# EAGLE design Eitech-Robotics_v10dev (EAGLE 7.7.0)
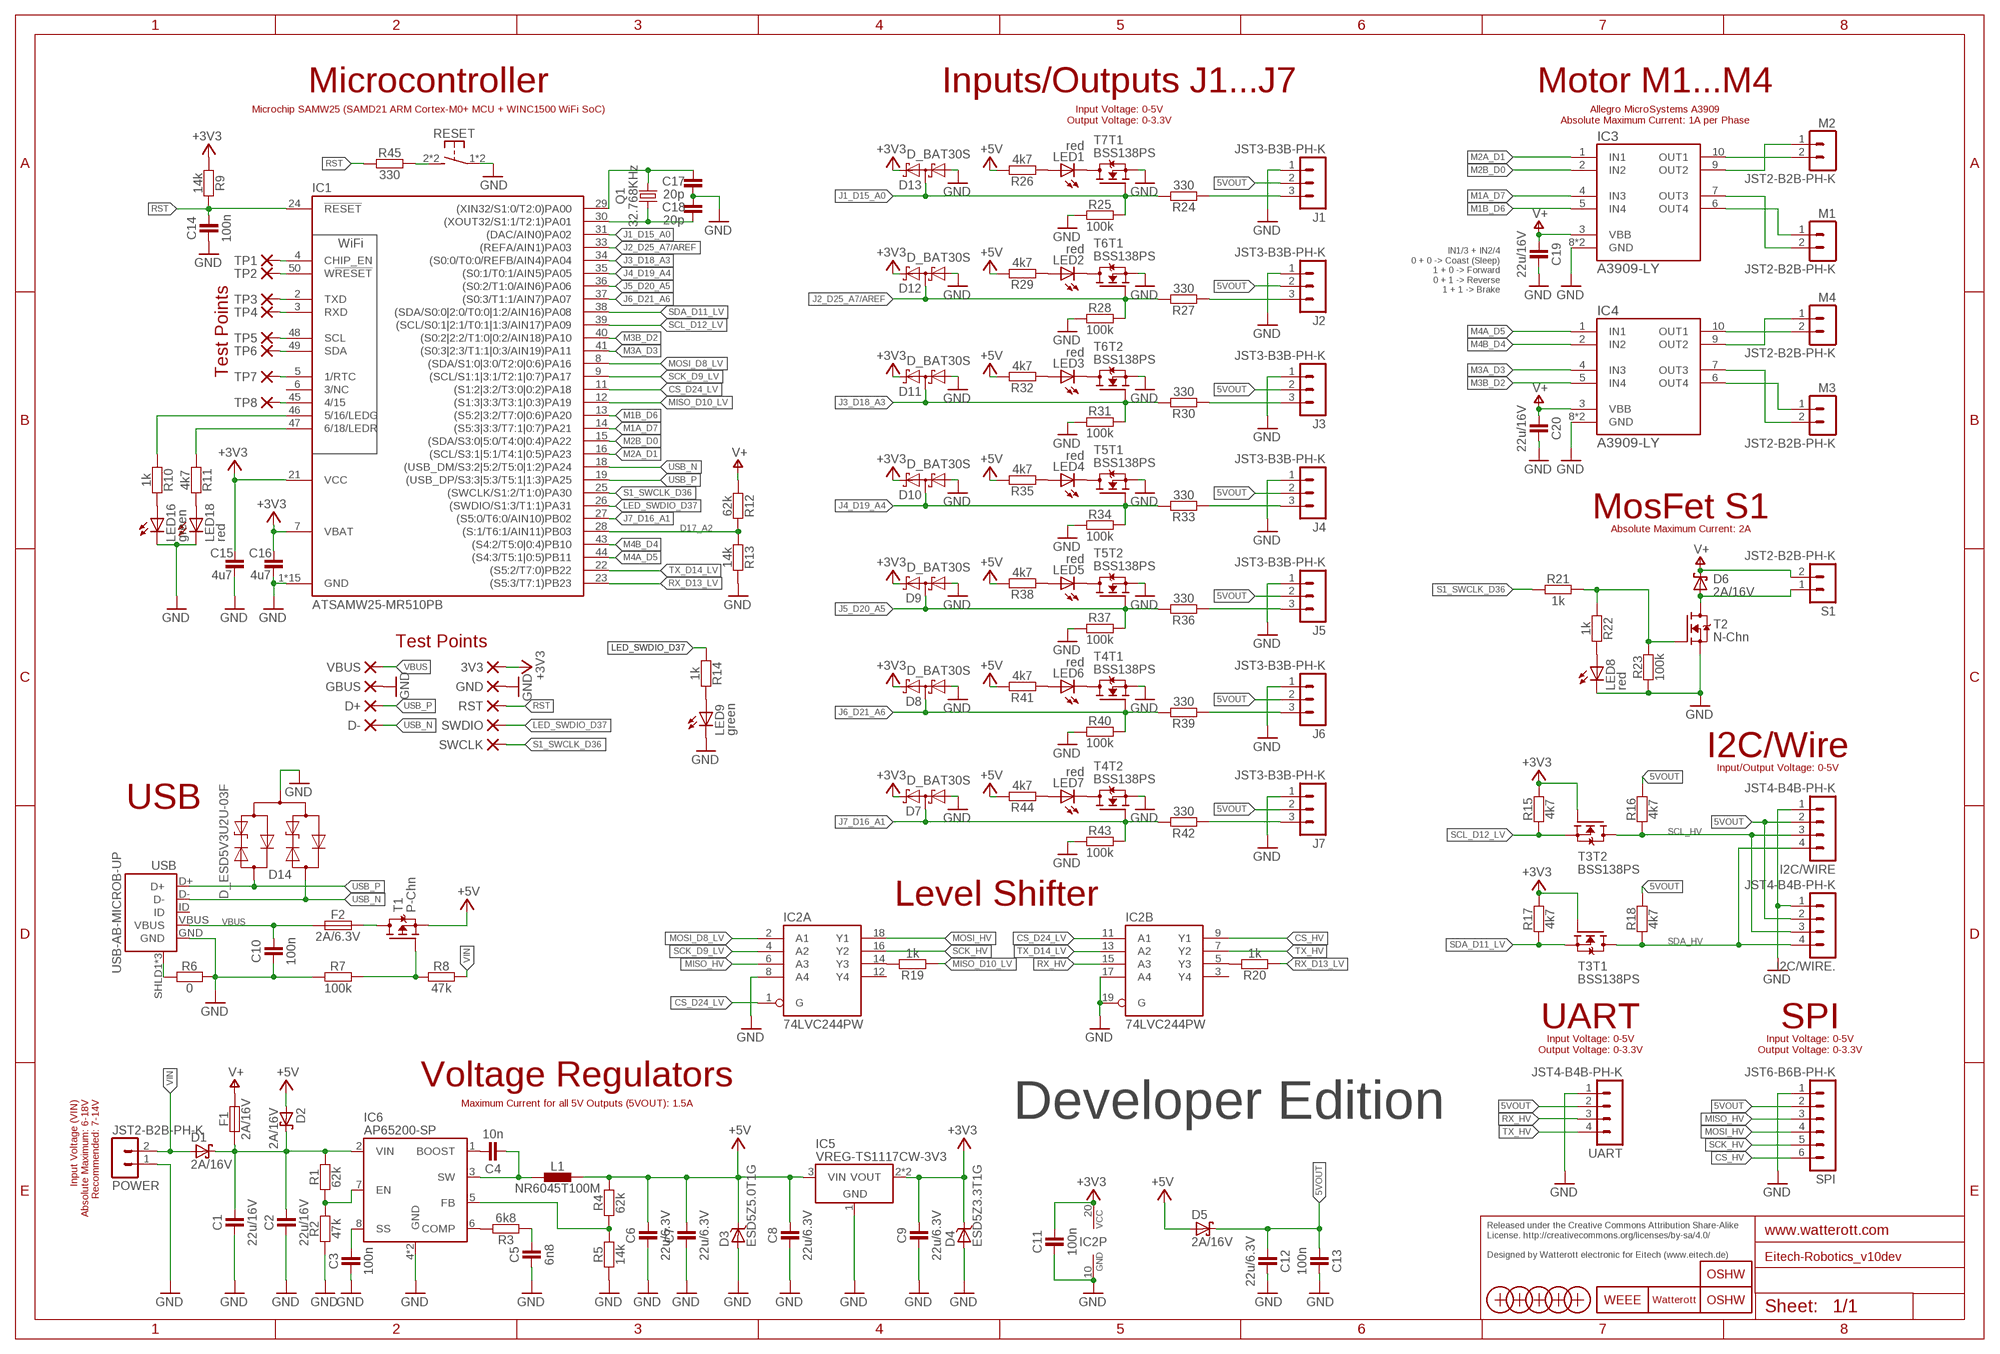
[diagram p0: schematic, sheet 1]

## Parts
3V3  PAD-1.0_NC  [PAD-1.0_NC]
C1  22u/16V  CAPACITOR-0805  [C0805]
C2  22u/16V  CAPACITOR-0805  [C0805]
C3  100n  CAPACITOR-0402  [C0402]
C4  10n  CAPACITOR-0402  [C0402]
C5  6n8  CAPACITOR-0402  [C0402]
C6  22u/6.3V  CAPACITOR-0805  [C0805]
C7  22u/6.3V  CAPACITOR-0805  [C0805]
C8  22u/6.3V  CAPACITOR-0805  [C0805]
C9  22u/6.3V  CAPACITOR-0805  [C0805]
C10  100n  CAPACITOR-0402  [C0402]
C11  100n  CAPACITOR-0402  [C0402]
C12  22u/6.3V  CAPACITOR-0805  [C0805]
C13  100n  CAPACITOR-0402  [C0402]
C14  100n  CAPACITOR-0402  [C0402]
C15  4u7  CAPACITOR-0603  [C0603]
C16  4u7  CAPACITOR-0603  [C0603]
C17  20p  CAPACITOR-0402  [C0402]
C18  20p  CAPACITOR-0402  [C0402]
C19  22u/16V  CAPACITOR-0805  [C0805]
C20  22u/16V  CAPACITOR-0805  [C0805]
D1  2A/16V  D_SCHOTTKY-SMA  [SMA_DO214AC]
D2  2A/16V  D_SCHOTTKY-SMA  [SMA_DO214AC]
D3  ESD5Z5.0T1G  D_TVS-SOD523  [SOD523]
D4  ESD5Z3.3T1G  D_TVS-SOD523  [SOD523]
D5  2A/16V  D_SCHOTTKY-SMA  [SMA_DO214AC]
D6  2A/16V  D_SCHOTTKY-SMA  [SMA_DO214AC]
D7  D_BAT30S  [SOT323]
D8  D_BAT30S  [SOT323]
D9  D_BAT30S  [SOT323]
D10  D_BAT30S  [SOT323]
D11  D_BAT30S  [SOT323]
D12  D_BAT30S  [SOT323]
D13  D_BAT30S  [SOT323]
D14  D_ESD5V3U2U-03F  [SOT723]
D+  PAD-1.0_NC  [PAD-1.0_NC]
D-  PAD-1.0_NC  [PAD-1.0_NC]
F1  2A/16V  FUSE-1812  [C1812]
F2  2A/6.3V  FUSE-1206  [C1206]
GBUS  PAD-1.0_NC  [PAD-1.0_NC]
GND  PAD-1.0_NC  [PAD-1.0_NC]
I2C/WIRE  JST4-B4B-PH-K  [JST_B4B-PH-K]
I2C/WIRE.  JST4-B4B-PH-K  [JST_B4B-PH-K]
IC1  ATSAMW25-MR510PB  [ATSAMW25-MRX10]
IC2  74LVC244PW  [TSSOP20]
IC3  A3909-LY  [MSOP10-PAD]
IC4  A3909-LY  [MSOP10-PAD]
IC5  VREG-TS1117CW-3V3  [SOT223]
IC6  AP65200-SP  [SO08-PAD]
J1  JST3-B3B-PH-K  [JST_B3B-PH-K]
J2  JST3-B3B-PH-K  [JST_B3B-PH-K]
J3  JST3-B3B-PH-K  [JST_B3B-PH-K]
J4  JST3-B3B-PH-K  [JST_B3B-PH-K]
J5  JST3-B3B-PH-K  [JST_B3B-PH-K]
J6  JST3-B3B-PH-K  [JST_B3B-PH-K]
J7  JST3-B3B-PH-K  [JST_B3B-PH-K]
L1  NR6045T100M  INDUCTOR-NR60XX  [L_NR60XX]
LED1  red  LED-0603  [C0603]
LED2  red  LED-0603  [C0603]
LED3  red  LED-0603  [C0603]
LED4  red  LED-0603  [C0603]
LED5  red  LED-0603  [C0603]
LED6  red  LED-0603  [C0603]
LED7  red  LED-0603  [C0603]
LED8  red  LED-0603  [C0603]
LED9  green  LED-0603  [C0603]
LED16  green  LED-0603  [C0603]
LED18  red  LED-0603  [C0603]
LOGO1  OSHW_LOGOX0100  [OSHW_6X100]
LOGO2  WEEE_LOGO-S  [WEEE_TPLAC_S]
LOGO3  LOGO-S_PLACE_S  [SPARK_TPLACE_S]
LOGO4  OSHW_LOGOX0150  [OSHW_6X150]
M1  JST2-B2B-PH-K  [JST_B2B-PH-K]
M2  JST2-B2B-PH-K  [JST_B2B-PH-K]
M3  JST2-B2B-PH-K  [JST_B2B-PH-K]
M4  JST2-B2B-PH-K  [JST_B2B-PH-K]
POWER  JST2-B2B-PH-K  [JST_B2B-PH-K]
Q1  32.768KHz  CRYSTAL-ZM315  [CRYSTAL_ZM315]
R1  62k  RESISTOR-0402  [C0402]
R2  47k  RESISTOR-0402  [C0402]
R3  6k8  RESISTOR-0402  [C0402]
R4  62k  RESISTOR-0402  [C0402]
R5  14k  RESISTOR-0402  [C0402]
R6  0  RESISTOR-0402  [C0402]
R7  100k  RESISTOR-0402  [C0402]
R8  47k  RESISTOR-0402  [C0402]
R9  14k  RESISTOR-0402  [C0402]
R10  1k  RESISTOR-0402  [C0402]
R11  4k7  RESISTOR-0402  [C0402]
R12  62k  RESISTOR-0402  [C0402]
R13  14k  RESISTOR-0402  [C0402]
R14  1k  RESISTOR-0402  [C0402]
R15  4k7  RESISTOR-0402  [C0402]
R16  4k7  RESISTOR-0402  [C0402]
R17  4k7  RESISTOR-0402  [C0402]
R18  4k7  RESISTOR-0402  [C0402]
R19  1k  RESISTOR-0402  [C0402]
R20  1k  RESISTOR-0402  [C0402]
R21  1k  RESISTOR-0402  [C0402]
R22  1k  RESISTOR-0402  [C0402]
R23  100k  RESISTOR-0402  [C0402]
R24  330  RESISTOR-0402  [C0402]
R25  100k  RESISTOR-0402  [C0402]
R26  4k7  RESISTOR-0402  [C0402]
R27  330  RESISTOR-0402  [C0402]
R28  100k  RESISTOR-0402  [C0402]
R29  4k7  RESISTOR-0402  [C0402]
R30  330  RESISTOR-0402  [C0402]
R31  100k  RESISTOR-0402  [C0402]
R32  4k7  RESISTOR-0402  [C0402]
R33  330  RESISTOR-0402  [C0402]
R34  100k  RESISTOR-0402  [C0402]
R35  4k7  RESISTOR-0402  [C0402]
R36  330  RESISTOR-0402  [C0402]
R37  100k  RESISTOR-0402  [C0402]
R38  4k7  RESISTOR-0402  [C0402]
R39  330  RESISTOR-0402  [C0402]
R40  100k  RESISTOR-0402  [C0402]
R41  4k7  RESISTOR-0402  [C0402]
R42  330  RESISTOR-0402  [C0402]
R43  100k  RESISTOR-0402  [C0402]
R44  4k7  RESISTOR-0402  [C0402]
R45  330  RESISTOR-0402  [C0402]
RESET  SW-TACTILE-TL3305C  SW-TACTILE-TL3305  [TL3305]
RST  PAD-1.0_NC  [PAD-1.0_NC]
S1  JST2-B2B-PH-K  [JST_B2B-PH-K]
SPI  JST6-B6B-PH-K  [JST_B6B-PH-K]
SWCLK  PAD-1.0_NC  [PAD-1.0_NC]
SWDIO  PAD-1.0_NC  [PAD-1.0_NC]
T1  P-Chn  MOSFET-P-SOT23  [SOT23]
T2  N-Chn  MOSFET-N-SOT23  [SOT23]
T3  BSS138PS  [SOT363]
T4  BSS138PS  [SOT363]
T5  BSS138PS  [SOT363]
T6  BSS138PS  [SOT363]
T7  BSS138PS  [SOT363]
TP1  PAD-0.7_NC  [PAD-0.7_NC]
TP2  PAD-0.7_NC  [PAD-0.7_NC]
TP3  PAD-0.7_NC  [PAD-0.7_NC]
TP4  PAD-0.7_NC  [PAD-0.7_NC]
TP5  PAD-0.7_NC  [PAD-0.7_NC]
TP6  PAD-0.7_NC  [PAD-0.7_NC]
TP7  PAD-0.7_NC  [PAD-0.7_NC]
TP8  PAD-0.7_NC  [PAD-0.7_NC]
UART  JST4-B4B-PH-K  [JST_B4B-PH-K]
USB  USB-AB-MICROB-UP  [USB-MICROB-1051330011]
VBUS  PAD-1.0_NC  [PAD-1.0_NC]
X1  PASSER-07  [PASSER_07MM]
X2  PASSER-07  [PASSER_07MM]
X3  PASSER-07  [PASSER_07MM]
X4  PASSER-07  [PASSER_07MM]
X5  PASSER-04  [PASSER_04MM]

## Nets
5VOUT: C12.2 C13.2 D5.C I2C/WIRE.2 I2C/WIRE..2 J1.2 J2.2 J3.2 J4.2 J5.2 J6.2 J7.2 R16.2 R18.2 SPI.2 UART.2
+3V3: 3V3.1(P) C9.2 C11.2 C15.2 C16.2 D4.C D7.2(C) D8.2(C) D9.2(C) D10.2(C) D11.2(C) D12.2(C) D13.2(C) IC1.7(VBAT) IC1.21(VCC) IC2.20(P:VCC) IC5.2(VOUT) IC5.4(VOUT) R9.1 R15.2 R17.2 T3.2(T1:G) T3.5(T2:G)
+5V: C6.2 C7.2 C8.2 D2.A D3.C D5.A IC5.3(VIN) L1.2 R4.2 R26.2 R29.2 R32.2 R35.2 R38.2 R41.2 R44.2 T1.2(S)
BOOST: C4.2 IC6.1(BOOST)
CHIP_EN: IC1.4(CHIP_EN) TP1.1(P)
COMP: IC6.6(COMP) R3.2
CS_D24_LV: IC1.11((S1:2|3:2/T3:0|0:2)PA18) IC2.1(A:G) IC2.11(B:A1)
CS_HV: IC2.9(B:Y1) SPI.6
D17_A2: IC1.28((S:1/T6:1/AIN11)PB03) R12.2 R13.1
GND: C1.1 C2.1 C3.1 C5.1 C6.1 C7.1 C8.1 C9.1 C10.1 C11.1 C12.1 C13.1 C14.1 C15.1 C16.1 C17.2 C18.2 C19.2 C20.2 D3.A D4.A D7.1(A) D8.1(A) D9.1(A) D10.1(A) D11.1(A) D12.1(A) D13.1(A) D14.3(A) GBUS.1(P) GND.1(P) I2C/WIRE.1 I2C/WIRE..1 IC1.1(GND) IC1.10(GND) IC1.17(GND) IC1.20(GND) IC1.32(GND) IC1.42(GND) IC1.51(GND) IC1.GND@1(GND) IC1.GND@2(GND) IC1.GND@3(GND) IC1.GND@4(GND) IC1.GND@5(GND) IC1.GND@6(GND) IC1.GND@7(GND) IC1.GND@8(GND) IC2.8(A:A4) IC2.10(P:GND) IC2.17(B:A4) IC2.19(B:G) IC3.8(GND) IC3.TP(GND) IC4.8(GND) IC4.TP(GND) IC5.1(GND) IC6.4(GND) IC6.TP(GND) J1.1 J2.1 J3.1 J4.1 J5.1 J6.1 J7.1 LED8.C LED9.C LED16.C LED18.C POWER.1 R2.1 R5.1 R6.1 R7.1 R13.2 R23.1 R25.1 R28.1 R31.1 R34.1 R37.1 R40.1 R43.1 RESET.1 RESET.4(P1) SPI.1 T2.2(S) T4.1(T1:S) T4.4(T2:S) T5.1(T1:S) T5.4(T2:S) T6.1(T1:S) T6.4(T2:S) T7.1(T1:S) UART.1 USB.GND
IO15: IC1.45(4/15) TP8.1(P)
IO16: IC1.46(5/16/LEDG) R10.1
IO18: IC1.47(6/18/LEDR) R11.1
J1_D15_A0: D13.3(CA) IC1.31((DAC/AIN0)PA02) R24.2 R25.2 T7.2(T1:G)
J2_D25_A7/AREF: D12.3(CA) IC1.33((REFA/AIN1)PA03) R27.2 R28.2 T6.2(T1:G)
J3_D18_A3: D11.3(CA) IC1.34((S0:0/T0:0/REFB/AIN4)PA04) R30.2 R31.2 T6.5(T2:G)
J4_D19_A4: D10.3(CA) IC1.35((S0:1/T0:1/AIN5)PA05) R33.2 R34.2 T5.2(T1:G)
J5_D20_A5: D9.3(CA) IC1.36((S0:2/T1:0/AIN6)PA06) R36.2 R37.2 T5.5(T2:G)
J6_D21_A6: D8.3(CA) IC1.37((S0:3/T1:1/AIN7)PA07) R39.2 R40.2 T4.2(T1:G)
J7_D16_A1: D7.3(CA) IC1.27((S5:0/T6:0/AIN10)PB02) R42.2 R43.2 T4.5(T2:G)
LED_SWDIO_D37: IC1.26((SWDIO/S1:3/T1:1)PA31) R14.1 SWDIO.1(P)
M1_O1: IC3.7(OUT3) M1.2
M1_O2: IC3.6(OUT4) M1.1
M1A_D7: IC1.14((S5:3|3:3/T7:1|0:7)PA21) IC3.4(IN3)
M1B_D6: IC1.13((S5:2|3:2/T7:0|0:6)PA20) IC3.5(IN4)
M2_O1: IC3.10(OUT1) M2.2
M2_O2: IC3.9(OUT2) M2.1
M2A_D1: IC1.16((SCL/S3:1|5:1/T4:1|0:5)PA23) IC3.1(IN1)
M2B_D0: IC1.15((SDA/S3:0|5:0/T4:0|0:4)PA22) IC3.2(IN2)
M3_O1: IC4.7(OUT3) M3.2
M3_O2: IC4.6(OUT4) M3.1
M3A_D3: IC1.41((S0:3|2:3/T1:1|0:3/AIN19)PA11) IC4.4(IN3)
M3B_D2: IC1.40((S0:2|2:2/T1:0|0:2/AIN18)PA10) IC4.5(IN4)
M4_O1: IC4.10(OUT1) M4.2
M4_O2: IC4.9(OUT2) M4.1
M4A_D5: IC1.44((S4:3/T5:1|0:5)PB11) IC4.1(IN1)
M4B_D4: IC1.43((S4:2/T5:0|0:4)PB10) IC4.2(IN2)
MISO_D10_LV: IC1.12((S1:3|3:3/T3:1|0:3)PA19) R19.1
MISO_HV: IC2.6(A:A3) SPI.3
MISO_LV: IC2.14(A:Y3) R19.2
MOSI_D8_LV: IC1.8((SDA/S1:0|3:0/T2:0|0:6)PA16) IC2.2(A:A1)
MOSI_HV: IC2.18(A:Y1) SPI.4
N$1: LED8.A R22.2
N$2: J1.3 R24.1
N$3: F2.2 T1.3(D)
N$4: R7.2 R8.1 T1.1(G)
N$5: LED9.A R14.2
N$11: R21.2 R22.1 R23.2 T2.1(G)
N$16: LED7.C T4.3(T2:D)
N$17: LED7.A R44.1
N$18: J7.3 R42.1
N$22: C4.1 IC6.3(SW) L1.1
N$24: C3.2 IC6.8(SS)
N$25: J6.3 R39.1
N$26: J5.3 R36.1
N$27: J4.3 R33.1
N$29: IC6.5(FB) R4.1 R5.2
N$30: LED6.C T4.6(T1:D)
N$31: LED6.A R41.1
N$32: J2.3 R27.1
N$33: LED5.A R38.1
N$34: J3.3 R30.1
N$35: LED4.A R35.1
N$36: LED4.C T5.6(T1:D)
N$37: LED5.C T5.3(T2:D)
N$38: LED3.A R32.1
N$39: LED2.A R29.1
N$40: LED2.C T6.6(T1:D)
N$41: LED3.C T6.3(T2:D)
N$42: LED1.A R26.1
N$43: LED1.C T7.6(T1:D)
N$44: C5.2 R3.1
N$46: IC6.7(EN) R1.1 R2.2
N$60: LED18.A R11.2
N$61: LED16.A R10.2
RST: C14.2 IC1.24(!RESET) R9.2 R45.1 RST.1(P)
RST_SW: R45.2 RESET.2(S1) RESET.3(S1)
RTC: IC1.5(1/RTC) TP7.1(P)
RX_D13_LV: IC1.23((S5:3/T7:1)PB23) R20.1
RX_HV: IC2.15(B:A3) UART.3
RX_LV: IC2.5(B:Y3) R20.2
RXD: IC1.3(RXD) TP4.1(P)
S1: D6.A S1.1 T2.3(D)
S1_SWCLK_D36: IC1.25((SWCLK/S1:2/T1:0)PA30) R21.1 SWCLK.1(P)
SCK_D9_LV: IC1.9((SCL/S1:1|3:1/T2:1|0:7)PA17) IC2.4(A:A2)
SCK_HV: IC2.16(A:Y2) SPI.5
SCL: IC1.48(SCL) TP5.1(P)
SCL_D12_LV: IC1.39((SCL/S0:1|2:1/T0:1|1:3/AIN17)PA09) R15.1 T3.4(T2:S)
SCL_HV: I2C/WIRE.3 I2C/WIRE..3 R16.1 T3.3(T2:D)
SDA: IC1.49(SDA) TP6.1(P)
SDA_D11_LV: IC1.38((SDA/S0:0|2:0/T0:0|1:2/AIN16)PA08) R17.1 T3.1(T1:S)
SDA_HV: I2C/WIRE.4 I2C/WIRE..4 R18.1 T3.6(T1:D)
SHLD1: R6.2 USB.SHLD1(SHIELD) USB.SHLD2(SHIELD) USB.SHLD3(SHIELD)
TX_D14_LV: IC1.22((S5:2/T7:0)PB22) IC2.13(B:A2)
TX_HV: IC2.7(B:Y2) UART.4
TXD: IC1.2(TXD) TP3.1(P)
USB_N: D14.1(C1) D-.1(P) IC1.18((USB_DM/S3:2|5:2/T5:0|1:2)PA24) USB.D-
USB_P: D14.2(C2) D+.1(P) IC1.19((USB_DP/S3:3|5:3/T5:1|1:3)PA25) USB.D+
V+: C19.1 C20.1 D6.C F1.2 IC3.3(VBB) IC4.3(VBB) R12.1 S1.2
VBUS: C10.2 F2.1 USB.VBUS VBUS.1(P)
VIN: D1.A POWER.2 R8.2
VINP: C1.2 C2.2 D1.C D2.C F1.1 IC6.2(VIN) R1.2
WRST: IC1.50(W!RESET) TP2.1(P)
XIN: C17.1 IC1.29((XIN32/S1:0/T2:0)PA00) Q1.2
XOUT: C18.1 IC1.30((XOUT32/S1:1/T2:1)PA01) Q1.1
Unconnected: IC1.6(3/NC) IC2.3(B:Y4) IC2.12(A:Y4) T7.3(T2:D) T7.4(T2:S) T7.5(T2:G) USB.ID

## Notes on the sheet
- Microcontroller | Inputs/Outputs J1...J7 | Motor M1...M4
- Microchip SAMW25 (SAMD21 ARM Cortex-M0+ MCU + WINC1500 WiFi SoC)
- Input Voltage: 0-5V
  Output Voltage: 0-3.3V
- Allegro MicroSystems A3909
  Absolute Maximum Current: 1A per Phase
- IN1/3 + IN2/4
  0 + 0 -> Coast (Sleep)
  1 + 0 -> Forward
  0 + 1 -> Reverse
  1 + 1 -> Brake
- Test Points
- MosFet S1
- Absolute Maximum Current: 2A
- Test Points
- I2C/Wire
- Input/Output Voltage: 0-5V
- USB
- Level Shifter
- UART | SPI
- Input Voltage: 0-5V
  Output Voltage: 0-3.3V
- Input Voltage: 0-5V
  Output Voltage: 0-3.3V
- Voltage Regulators
- Input Voltage (VIN)
  Absolute Maximum: 6-18V
  Recommended: 7-14V
- Maximum Current for all 5V Outputs (5VOUT): 1.5A | Developer Edition
- Released under the Creative Commons Attribution Share-Alike 
  License. http://creativecommons.org/licenses/by-sa/4.0/
  
  Designed by Watterott electronic for Eitech (www.eitech.de)

## Library data of the parts
3V3 D+ D- GBUS GND RST SWCLK SWDIO TP1-TP8 VBUS = we-rcl:PAD: Pads and Test-Points
C1-C20 = we-rcl:CAPACITOR: Capacitors ...2.2uF @ 6.3V -> 0402 ...4.7uF @ 6.3V -> 0603 ...10uF @ 16V -> 0805 ...22uF @ 25V -> 1206
D1 D2 D5 D6 = we-rcl:D_SCHOTTKY: Schottky Diodes
D3 D4 = we-rcl:D_TVS: TVS Diodes (Transient Voltage Suppressor Diodes)
D7-D13 = we-rcl:D_BAT30S: Schottky Diode Array (1x series) If=300mA, Vf=0.5V, Vr=30V, 22pF@1MHz
D14 = we-rcl:D_ESD5V3U2U: TVS Diode - Uni-directional Ultra Low ESD / Transient Protection Diode Vrwm=5.3V, 0.4pF@1MHz; DIGIKEY: ESD5V3U2U-03F H6327DKR-ND
F1 F2 = we-rcl:FUSE: Fuses
I2C/WIRE I2C/WIRE. UART = we-con:JST4: JST Connector
IC1 = we-chip:ATSAMW25: Atmel ATSAMW25-MR510 ARM Cortex-M0 + WiFi/WLAN MR210PB - ATWINC1500 + SAM D21 MR510PB - ATWINC1500 + SAM D21 + ATECC508
IC2 = we-chip:74*244: 74x244 Octal Buffer and Line Driver (3-State); DIGIKEY: 568-1583-2-ND
IC3 IC4 = we-chip:A3909: Allegro A3909 Dual Full Bridge Motor Driver (4-18V)
IC5 = we-power:VREG: Voltage Regulators (LDOs, Switching Converters...) LDOs Taiwan Semi TS1117 800mA max 15V - compatible On Semi NCP1117 1A max 20V - compatible Diodes AP2111H 0.6A max 6V (0.25V@0.6A) - compatible Diodes AP2114H 1A max 6V (0.45V@1A) Taiwan Semi TS9011 250mA max 12V - compatible Diodes AP2210 300mA max 15V - compatible Microchip MCP1702 250mA max 13V - compatible Microchip MCP1703 250mA max 16V - compatible Microchip MCP1754 150mA max 16V Taiwan Semi TS5204 150mA max 16V (low noise) DC/DC Converter Modules Recom R-78Ex.x-1.0-W36 1A max 28V - compatible CUI V78xx-2000 2A max 18V Murata OKI-78SR-x.x/1.5-W36 1.5A max 36V
IC6 = we-power:AP65200: Diodes AP65200 Step-Down (340kHz, 2A, 4.7-18V input) 5.0V - R1=44.2k, R2=10k or R1=62k, R2=14k 3.3V - R1=26.1k, R2=10k or R1=39k, R2=15k 2.5V - R1=16.9k, R2=10k L=10uH, Cin=22uF, Cout=47uF, Cc=6.8nF, Rc=6.8k SO08-PAD compatible Switching Converters AP65200 - 340kHz, 2A, 4.7-18V input AP6502 - 340kHz, 2A, 4.7-18V input AP6502A - 240kHz, 2A, 4.7-23V input AP3512E - 500kHz, 2A, 4.5-18V input AP6503 - 340kHz, 3A, 4.7-18V input AP6503A - 240kHz, 3A, 4.7-23V input AP3503E - 340kHz, 3A, 4.5-18V input AP3513E - 500kHz, 3A, 4.5-18V input AP65400 - 340kHz, 4A, 4.7-18V input AP65402 - 500kHz, 4A, 4.7-17V input AP65403 - 750kHz, 4A, 4.7-18V input AP65500 - 340kHz, 5A, 4.7-18V input AP65502 - 500kHz, 5A, 4.7-17V input AP65503 - 750kHz, 5A, 4.7-17V input
J1-J7 = we-con:JST3: JST Connector
L1 = we-power:INDUCTOR: Power Inductors Taiyo Yuden NR6028 NR6028T0R9N - 0.9uH, Ir=6.6A NR6028T1R5N - 1.5uH, Ir=5.0A NR6028T2R2N - 2.2uH, Ir=4.2A NR6028T3R0N - 3.0uH, Ir=3.6A NR6028T4R7M - 4.7uH, Ir=2.7A NR6028T6R0M - 6.0uH, Ir=2.5A NR6028T100M - 10uH, Ir=1.9A NR6028T150M - 15uH, Ir=1.6A NR6028T220M - 22uH, Ir=1.3A NR6028T330M - 33uH, Ir=1.1A NR6028T470M - 47uH, Ir=0.95A NR6028T680M - 68uH, Ir=0.76A NR6028T101M - 100uH, Ir=0.62A Taiyo Yuden NR6045 NR6045T1R0N - 1.0uH, Ir=8.5A NR6045T1R3N - 1.3uH, Ir=8.0A NR6045T1R8N - 1.8uH, Ir=7.0A NR6045T2R3N - 2.3uH, Ir=6.0A NR6045T3R0N - 3.0uH, Ir=5.0A NR6045T4R5M - 4.5uH, Ir=4.0A NR6045T6R3M - 6.3uH, Ir=3.8A NR6045T100M - 10uH, Ir=3.0A NR6045T150M - 15uH, Ir=2.3A NR6045T220M - 22uH, Ir=1.9A NR6045T330M - 33uH, Ir=1.5A NR6045T470M - 47uH, Ir=1.3A NR6045T680M - 68uH, Ir=1.0A NR6045T101M - 100uH, Ir=0.8A
LED1-LED9 LED16 LED18 = we-opto:LED: LEDs red, green, blue -> 0603
LOGO1 LOGO4 = we-symbol:OSHW_LOGO: Open-Source-Hardware Logo
LOGO2 = we-symbol:WEEE_LOGO: WEEE Logo
LOGO3 = we-symbol:LOGO: Watterott electronic Logo
M1-M4 POWER S1 = we-con:JST2: JST Connector
Q1 = we-rcl:CRYSTAL: Crystals
R1-R45 = we-rcl:RESISTOR: Resistors all kinds in 0402 and 0603
RESET = we-switch:SW-TACTILE: Tactile Switches; HEIGHT: 7.0mm; MPN: TL3305C
SPI = we-con:JST6: JST Connector
T1 = we-transistor:MOSFET-P: P-Channel MOSFET TSM3401, IRLML6402 (Vds>=20V, Id>=2A + Rds<=0.1Ohm @ Vgs=4.5V)
T2 = we-transistor:MOSFET-N: N-Channel MOSFET TSM3404, IRLML2502 (Vgs>=+/-20V, Vds>=20V, Id>=3A + Rds<=0.05Ohm @ Vgs=4.5V) BSS138 (Vgs>=+/-20V, Vds>=40V, Id>=0.2A + Rds<=3Ohm @ Vgs=4.5V)
T3-T7 = we-transistor:BSS138PS: Dual N-Channel MOSFET BSS138 (Vgs>=+/-20V, Vds>=40V, Id>=0.2A + Rds<=3Ohm @ Vgs=4.5V)
USB = we-con:USB-AB: USB Connectors with ID-Pin (5 Pins); DIGIKEY: WM10134DKR-ND
X1-X5 = we-symbol:PASSER: Fiducial Markers

## Board
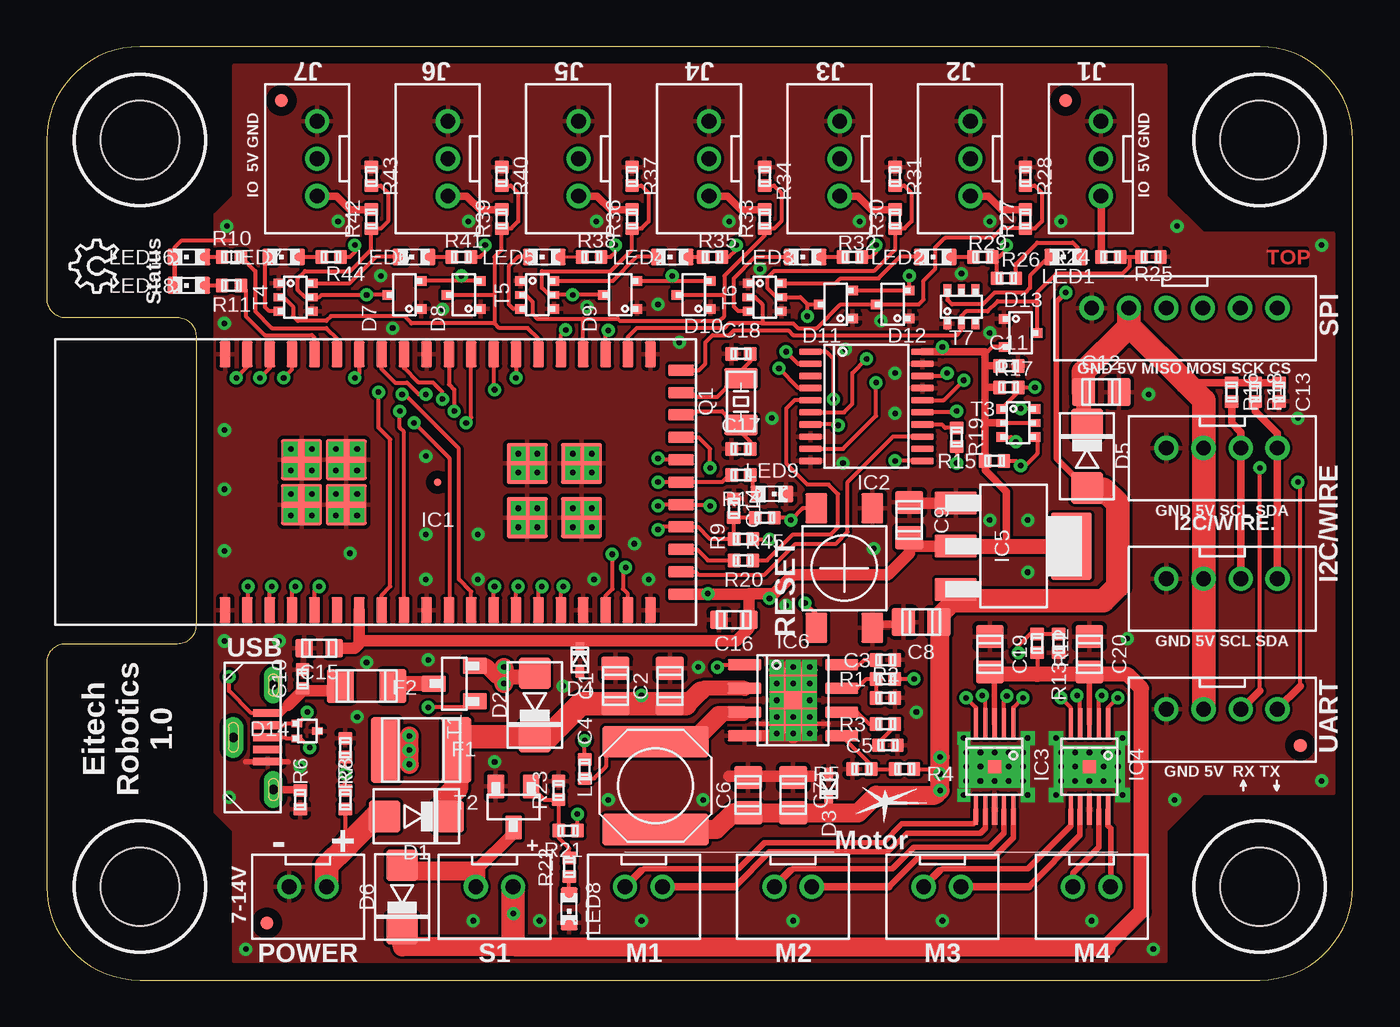
[diagram p1: board, top side]
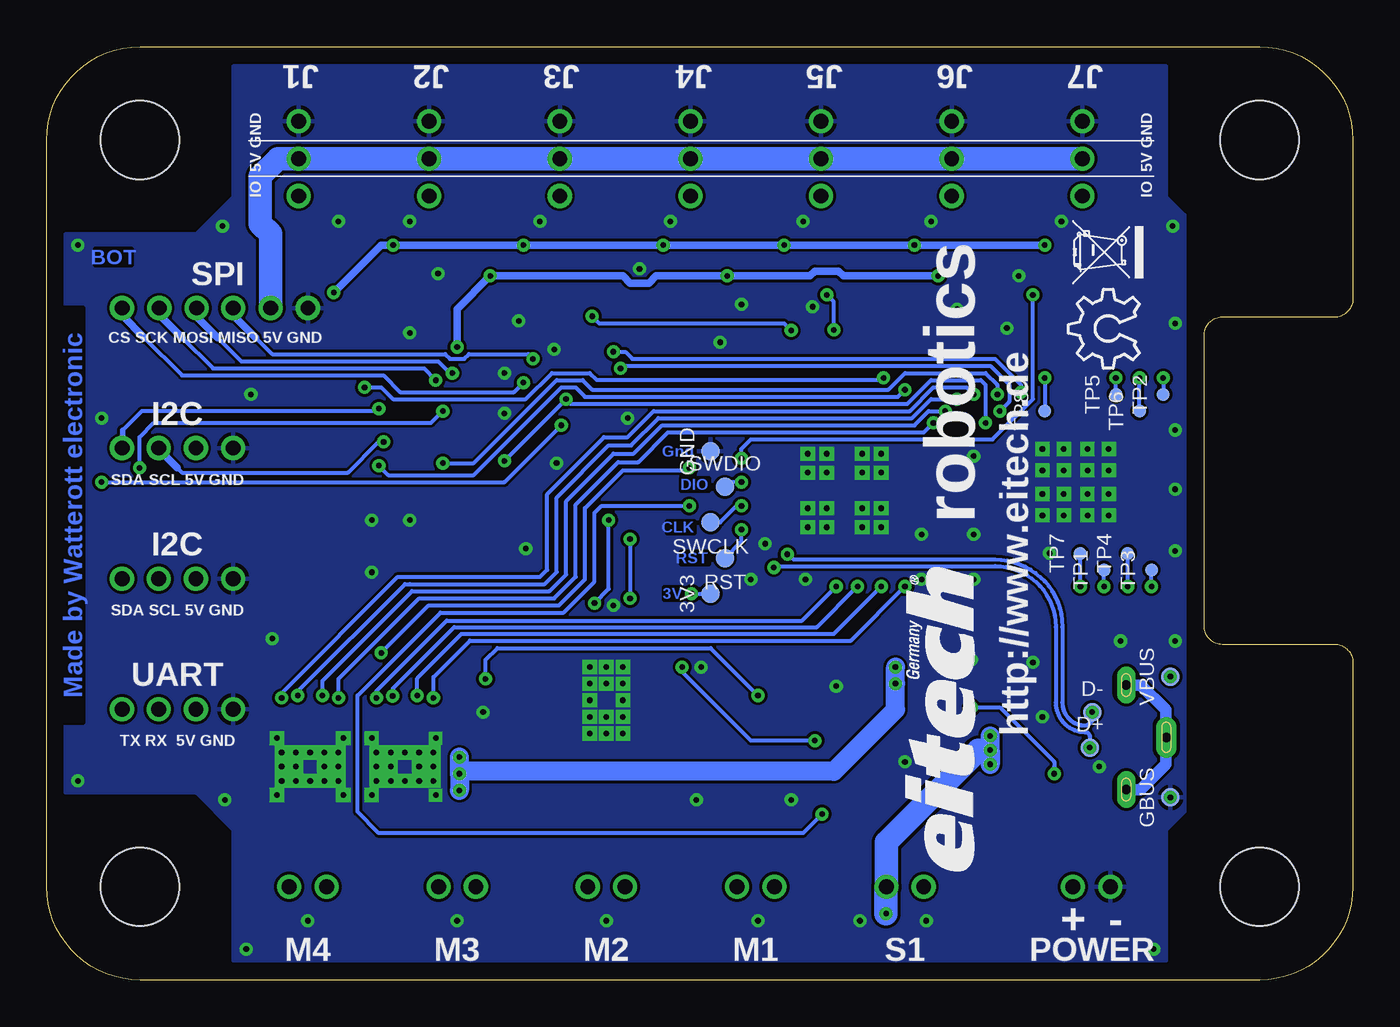
[diagram p2: board, bottom side, seen from below]

Size 70 x 50 mm. Coordinates in mm from the lower left corner, seen from the top.
Outline: 5,0 65,0 arc90 70,5 70,45 arc90 65,50 5,50 arc90 0,45 0,36.5 arc90 1,35.5 7,35.5 arc-90 8,34.5 8,19 arc-90 7,18 1,18 arc90 0,17 0,5 arc90 5,0
Copper layers (1*16): Top 0.035mm / dielectric 1.5mm / Bottom 0.035mm
Design rules "we-dru-2-layer *": minimum track width 0.15mm, minimum drill 0.3mm, track to track 0.15mm, track to pad 0.15mm, pad to pad 0.15mm, via to via 0.15mm, smd to smd 0.1mm, copper to edge 0.5mm, drill to drill 0.2mm, minimum pad ring 0.18mm, minimum via ring 0.2mm, stop-mask expansion 0.1mm, vias tented up to drill 0.5mm, thermal gap 0.2mm
Holes 4.2 mm at 5,45 5,5 65,5 65,45

### Footprints (pad centres in the part's own frame; a part is rotated, then mirrored left to right if it is on the bottom)
PAD-1.0_NC = smd 1 x 1: 1 0,0
C0805 = smd 1.5 x 1.25: 1 0,0.95; 2 0,-0.95
C0402 = smd 0.75 x 0.7: 1 0,0.5; 2 0,-0.5
C0603 = smd 1 x 0.95: 1 0,0.8; 2 0,-0.8
SMA_DO214AC = smd 1.7 x 1.7: A 0,-1.7; C 0,1.7
SOD523 = smd 0.5 x 0.7: A 0,-0.6; C 0,0.6
SOT323 = smd 0.6 x 0.5: 1 -0.9,0.75; 2 -0.9,-0.75; 3 0.9,0
SOT723 = smd 0.6 x 0.4: 1 -0.55,0.4; 2 -0.55,-0.4; 3 0.55,0
C1812 = smd 3.5 x 1.6: 1 0,1.9; 2 0,-1.9
C1206 = smd 1.8 x 1.45: 1 0,1.4; 2 0,-1.4
JST_B4B-PH-K = drill 0.8 pad 1.3: 1 0,3; 2 0,1; 3 0,-1; 4 0,-2.96
ATSAMW25-MRX10 = smd 1.4 x 0.6: 1 -6.85,11.4; 2 -6.85,10.2; 3 -6.85,9; 4 -6.85,7.8; 5 -6.85,6.6; 6 -6.85,5.4; 7 -6.85,4.2; 8 -6.85,3; 9 -6.85,1.8; 10 -6.85,0.6; 11 -6.85,-0.6; 12 -6.85,-1.8; 13 -6.85,-3; 14 -6.85,-4.2; 15 -6.85,-5.4; 16 -6.85,-6.6; 17 -6.85,-7.8; 18 -6.85,-9; 19 -6.85,-10.2; 20 -6.85,-11.4; 32 6.85,-11.4; 33 6.85,-10.2; 34 6.85,-9; 35 6.85,-7.8; 36 6.85,-6.6; 37 6.85,-5.4; 38 6.85,-4.2; 39 6.85,-3; 40 6.85,-1.8; 41 6.85,-0.6; 42 6.85,0.6; 43 6.85,1.8; 44 6.85,3; 45 6.85,4.2; 46 6.85,5.4; 47 6.85,6.6; 48 6.85,7.8; 49 6.85,9; 50 6.85,10.2; 51 6.85,11.4 | smd 0.6 x 1.4: 21 -6,-13.05; 22 -4.8,-13.05; 23 -3.6,-13.05; 24 -2.4,-13.05; 25 -1.2,-13.05; 26 0,-13.05; 27 1.2,-13.05; 28 2.4,-13.05; 29 3.6,-13.05; 30 4.8,-13.05; 31 6,-13.05 | smd 2.2 x 2.2: GND@1 -1.2,7.3; GND@2 1.2,7.3; GND@3 -1.2,4.9; GND@4 1.2,4.9; GND@5 -1.9,-4.8; GND@6 1,-4.8; GND@7 -1.9,-7.7; GND@8 1,-7.7
TSSOP20 = smd 1.2 x 0.35: 1 -3,2.925; 2 -3,2.275; 3 -3,1.625; 4 -3,0.975; 5 -3,0.325; 6 -3,-0.325; 7 -3,-0.975; 8 -3,-1.625; 9 -3,-2.275; 10 -3,-2.925; 11 3,-2.925; 12 3,-2.275; 13 3,-1.625; 14 3,-0.975; 15 3,-0.325; 16 3,0.325; 17 3,0.975; 18 3,1.625; 19 3,2.275; 20 3,2.925
MSOP10-PAD = smd 1.65 x 0.28: 1 -2.3,1; 2 -2.3,0.5; 3 -2.3,0; 4 -2.3,-0.5; 5 -2.3,-1; 6 2.3,-1; 7 2.3,-0.5; 8 2.3,0; 9 2.3,0.5; 10 2.3,1 | smd 1.73 x 2: TP 0,0
SOT223 = smd 2.235 x 1.219: 1 -3.099,2.311; 2 -3.099,0; 3 -3.099,-2.311 | smd 2.2 x 3.6: 4 3.099,0
SO08-PAD = smd 1.8 x 0.6: 1 -2.6,1.905; 2 -2.6,0.635; 3 -2.6,-0.635; 4 -2.6,-1.905; 5 2.6,-1.905; 6 2.6,-0.635; 7 2.6,0.635; 8 2.6,1.905 | smd 2.6 x 3.5: TP 0,0
JST_B3B-PH-K = drill 0.8 pad 1.3: 1 0,2; 2 0,0; 3 0,-2
L_NR60XX = smd 5.7 x 1.7: 1 0,2.35; 2 0,-2.35
C0603' = smd 0.9 x 0.8: A 0,-0.75; C 0,0.75
JST_B2B-PH-K = drill 0.8 pad 1.3: 1 0,1; 2 0,-1
CRYSTAL_ZM315 = smd 1.8 x 1.1: 1 0,1.25; 2 0,-1.25
TL3305 = smd 1.6 x 1.2: 1 -3.2,1.5; 2 -3.2,-1.5; 3 3.2,-1.5; 4 3.2,1.5
JST_B6B-PH-K = drill 0.8 pad 1.3: 1 0,5; 2 0,3; 3 0,1; 4 0,-0.96; 5 0,-2.96; 6 0,-4.96
SOT23 = smd 1.3 x 0.9: 1 -1.1,0.95; 2 -1.1,-0.95; 3 1.1,0
SOT363 = smd 0.6 x 0.5: 1 -0.9,0.75; 3 -0.9,-0.75; 4 0.9,-0.75; 6 0.9,0.75 | smd 0.6 x 0.4: 2 -0.9,0; 5 0.9,0
PAD-0.7_NC = smd 0.7 x 0.7: 1 0,0
USB-MICROB-1051330011 = smd 1.6 x 0.4: D+ -1.85,0; D- -1.85,-0.65; GND -1.85,1.3; ID -1.85,0.65; VBUS -1.85,-1.3 | drill 0.5 pad 1 long: SHLD1 -2.15,2.8; SHLD2 -2.15,-2.8 | drill 0.5 pad 1.1 long: SHLD3 0,0
PASSER_07MM = smd 0.7 x 0.7: X 0,0
PASSER_04MM = smd 0.4 x 0.4: X 0,0

### Placement (x,y rotation side)
3V3  34.42,20.7 0 bottom
C1  30.48,15.75 0 top
C2  33.4,15.75 0 top
C3  44.96,17.14 270 top
C4  28.83,11.3 180 top
C5  45.09,12.57 270 top
C6  37.59,9.91 0 top
C7  40.01,9.91 0 top
C8  46.86,19.18 90 top
C9  46.23,24.64 0 top
C10  13.72,16.13 0 top
C11  51.56,32.89 270 top
C12  56.52,31.5 270 top
C13  66.04,31.5 180 top
C14  36.83,25.27 0 top
C15  14.61,17.78 90 top
C16  36.83,19.3 90 top
C17  37.21,28.45 270 top
C18  37.21,33.54 270 top
C19  50.55,17.45 180 top
C20  55.88,17.45 180 top
D1  19.81,8.76 270 top
D2  26.16,14.73 180 top
D3  41.91,10.41 180 top
D4  28.57,17.14 0 top
D5  55.75,28.07 0 top
D6  19.05,4.45 180 top
D7  19.18,36.7 180 top
D8  22.35,36.7 180 top
D9  30.73,36.7 180 top
D10  34.67,36.7 180 top
D11  42.29,36.2 180 top
D12  45.34,36.2 180 top
D13  52.2,34.67 0 top
D14  13.97,13.34 0 top
D+  14.1,12.45 270 bottom
D-  13.97,14.35 270 bottom
F1  20.07,12.32 270 top
F2  17.14,15.75 90 top
GBUS  9.78,9.78 0 bottom
GND  34.42,28.32 0 bottom
I2C/WIRE  63,28.5 90 top
I2C/WIRE.  63,21.5 90 top
IC1  20.95,26.67 90 top
IC2  43.94,30.73 0 top
IC3  50.8,11.43 270 top
IC4  55.88,11.43 270 top
IC5  51.82,23.24 0 top
IC6  40.01,14.99 0 top
J1  56.5,44 0 top
J2  49.5,44 0 top
J3  42.5,44 0 top
J4  35.5,44 0 top
J5  28.5,44 0 top
J6  21.5,44 0 top
J7  14.5,44 0 top
L1  32.64,10.41 0 top
LED1  red  [C0603']  54.61,38.73 90 top
LED2  red  [C0603']  47.62,38.73 90 top
LED3  red  [C0603']  40.64,38.73 90 top
LED4  red  [C0603']  33.53,38.73 90 top
LED5  red  [C0603']  26.67,38.73 90 top
LED6  red  [C0603']  19.68,38.73 90 top
LED7  red  [C0603']  12.7,38.73 90 top
LED8  red  [C0603']  28,3.81 180 top
LED9  green  [C0603']  38.86,26.04 270 top
LED16  green  [C0603']  7.62,38.73 90 top
LED18  red  [C0603']  7.62,37.21 90 top
LOGO1  3.81,36.83 90 top
LOGO2  13.59,38.99 90 bottom
LOGO3  44.96,9.53 0 top
LOGO4  11.43,32.77 90 bottom
M1  32,5 90 top
M2  40,5 90 top
M3  48,5 90 top
M4  56,5 90 top
POWER  14,5 90 top
Q1  37.21,30.99 0 top
R1  44.96,16.13 90 top
R2  44.96,15.11 270 top
R3  44.96,13.72 270 top
R4  45.97,11.3 90 top
R5  43.69,11.3 90 top
R6  13.59,9.65 180 top
R7  16,12.45 0 top
R8  16,9.65 0 top
R9  37.34,23.62 270 top
R10  9.91,38.73 270 top
R11  9.91,37.21 270 top
R12  53.09,18.03 180 top
R13  54.23,18.03 0 top
R14  37.21,27.05 90 top
R15  50.8,27.81 270 top
R16  63.5,31.5 180 top
R17  51.56,31.75 270 top
R18  64.77,31.5 180 top
R19  48.77,29.08 180 top
R20  37.34,22.48 90 top
R21  27.94,8 270 top
R22  28,6.03 0 top
R23  27.43,10.16 0 top
R24  57.02,38.73 90 top
R25  59.18,38.73 270 top
R26  51.44,37.59 270 top
R27  52.45,40.77 0 top
R28  52.45,43.05 0 top
R29  50.16,38.73 90 top
R30  45.47,40.77 0 top
R31  45.47,43.05 0 top
R32  43.18,38.73 90 top
R33  38.48,40.77 0 top
R34  38.48,43.05 0 top
R35  35.69,38.73 90 top
R36  31.37,40.77 0 top
R37  31.37,43.05 0 top
R38  29.21,38.73 90 top
R39  24.38,40.77 0 top
R40  24.38,43.05 0 top
R41  22.23,38.73 90 top
R42  17.4,40.77 0 top
R43  17.4,43.05 0 top
R44  15.24,38.73 90 top
R45  38.48,24.77 90 top
RESET  42.75,22.07 270 top
RST  33.66,22.61 90 bottom
S1  24,5 90 top
SPI  61,36 90 top
SWCLK  34.42,24.51 90 bottom
SWDIO  33.66,26.42 270 bottom
T1  21.84,15.88 180 top
T2  25.02,9.27 270 top
T3  52.07,29.84 0 top
T4  13.34,36.58 0 top
T5  26.29,36.7 0 top
T6  38.48,36.58 0 top
T7  49.02,36.07 90 top
TP1  13.34,21.97 0 bottom
TP2  10.16,31.37 0 bottom
TP3  10.79,21.97 0 bottom
TP4  12.06,22.86 0 bottom
TP5  12.7,31.37 0 bottom
TP6  11.43,30.48 0 bottom
TP7  14.61,22.86 0 bottom
TP8  16.51,30.48 0 bottom
UART  63,14.5 90 top
USB  10,13 180 top
VBUS  9.78,16.26 0 bottom
X1  11.81,3.05 0 top
X2  12.57,47.12 0 top
X3  54.61,47.12 0 top
X4  67.18,12.57 0 top
X5  20.95,26.67 0 top

### Tracks (layer width: path | path; a pad name or v marks a point on that pad's centre or on a via)
5VOUT
  Top 0.406: C13.2 R18.2 R16.2 61.08,32 61.07,31.98
  Top 0.813: C12.2 55.56,29.95 D5.C
  Top 1.27: UART.2 I2C/WIRE..2 I2C/WIRE.2 62,31.05 61.07,31.98 58,35.05 | SPI.2 58,35.05 | 58,35.05 58,34.92 | 58,34.92 58,34.89 | C12.2 55.56,32.58 57.91,34.92 58,34.92
  Bottom 1.27: SPI.2 58,39.97 58.55,40.51 58.55,43.05 57.6,44 J1.2 J2.2 J3.2 J4.2 J5.2 J6.2 J7.2
+3V3  (via drill 0.3)
  Top 0.203: 50.29,33.66 50.42,33.66 50.69,33.92 D13.2 | T3.2 T3.5 | 51.44,23.25 51.44,23.24 | IC2.20 | R9.1 v38.73,23.62 | D8.2 22.23,37.45 | 22.23,37.45 D7.2 | D9.2 33.53,37.45 | 33.53,37.45 D10.2 | D11.2 D12.2 46.23,36.96 v46.23,37.72 | v22.23,37.72 22.23,37.45 | v33.53,37.72 33.53,37.45 | v35.43,20.7 35.43,20.67 | D4.C 28.57,18.16
  Top 0.406: 48.01,33.66 IC2.20 | 51.44,23.25 51.44,26.15 50.3,27.3 R15.2 50.3,28.19 50.29,28.19 50.29,29.84 | 50.29,29.84 50.29,31.75 | 50.29,31.75 50.29,32.89 | 50.29,32.89 50.29,33.66 48.01,33.66 | T3.2 50.29,29.84 | R17.2 50.29,31.75 | v48.01,33.91 48.01,33.66 | C11.2 50.29,32.89
  Top 0.61: 16.75,18.17 16.76,18.16 28.57,18.16 36.96,18.16 37.63,18.83 C16.2 37.63,20.66 | IC1.7 16.75,18.17 | 16.75,18.17 16.75,18.02 16.51,17.78 C15.2 | IC1.21 35.43,20.67 37.62,20.67 37.63,20.66 | 38.73,20.7 38.99,20.7 40.01,21.72 45.09,21.72 46.23,22.86 46.23,23.24 | v38.73,20.45 38.73,20.7 | 38.73,20.7 37.67,20.7 37.63,20.66 | 46.23,23.24 C9.2 | IC5.2 46.23,23.24
  Top 0.813: IC5.2 51.44,23.24 IC5.4
  Bottom 0.203: v38.73,23.62 v38.73,20.45 | v35.43,20.7 3V3.1
  Bottom 0.406: v48.01,33.91 48.01,35.94 v46.23,37.72 39.12,37.72 38.73,37.34 37.72,37.34 37.34,37.72 v33.53,37.72 29.08,37.72 28.83,37.97 27.56,37.97 27.3,37.72 v22.23,37.72
+5V  (via drill 0.3)
  Top 0.203: R44.2 16.26,38.73 16.51,38.99 v16.51,39.37 | R41.2 23.24,38.73 23.5,38.99 v23.5,39.37 | R35.2 36.58,38.73 36.96,39.12 v36.96,39.37 | R32.2 44.2,38.73 44.45,38.99 v44.45,39.37 | v51.44,39.37 51.44,39.12 51.05,38.73 R29.2 50.94,38.47 R26.2 | R38.2 30.23,38.73 30.48,38.99 v30.48,39.37 | R4.2 47.88,11.3 | D3.C 41.91,8.96
  Top 0.305: v54.61,36.83 54.1,36.32 54.1,27.94 55.63,26.42
  Top 0.406: 24.13,16.26 24.51,16.26
  Top 0.813: T1.2 23.56,16.82 24.13,16.26 | 24.51,16.26 25.99,16.26 D2.A
  Top 1.016: 24.51,16.75 24.51,16.26 v24.51,15.88 | L1.2 35.88,8.06 36.77,8.96 C6.2 C7.2 41.91,8.96 43.5,8.96 44.45,9.91 47.62,9.91 v47.88,10.16 v47.88,11.05 47.88,11.3 v47.88,11.94 47.88,19.11 C8.2 47.81,19.49 48.64,20.32 | IC5.3 48.72,20.37 48.77,20.32
  Top 1.27: 48.64,20.32 48.77,20.32 56.64,20.32 57.4,21.08 57.4,25.53 56.64,26.29 55.83,26.29 D5.A 55.75,26.29 55.63,26.42
  Bottom 0.406: v16.51,39.37 v23.5,39.37 v30.48,39.37 v36.96,39.37 v44.45,39.37 v51.44,39.37 52.07,39.37 v54.61,36.83
  Bottom 1.016: 47.88,11.18 27.81,11.18 24.51,14.48 v24.51,15.88 v24.51,16.76 | 47.88,11.18 v47.88,11.05 v47.88,10.16 | 47.88,11.18 v47.88,11.94
BOOST  (via drill 0.3)
  Top 0.203: C4.2 v28.83,12.83 | v35.94,16.76 36.07,16.89 IC6.1
  Bottom 0.203: v28.83,12.83 32.26,12.83 35.94,16.51 v35.94,16.76
CHIP_EN  (via drill 0.3)
  Top 0.203: IC1.4 13.15,20.9 v13.34,21.08
  Bottom 0.203: v13.34,21.08 TP1.1
COMP
  Top 0.203: IC6.6 43.43,14.35 44.07,13.72 R3.2
CS_D24_LV  (via drill 0.3)
  Top 0.203: IC2.11 v45.47,27.81 | v42.16,31.11 42.16,33.27 41.78,33.66 IC2.1 | v19.68,29.84 21.59,27.94 21.59,20.45 21.55,20.41 IC1.11
  Bottom 0.203: v45.47,27.81 v42.16,31.11 41.91,30.86 23.88,30.86 22.61,32.13 19.94,32.13 19.68,31.88 v19.68,29.84
CS_HV  (via drill 0.3)
  Top 0.203: IC2.9 42.68,28.46 44.45,30.23 v44.45,32
  Bottom 0.203: v44.45,32 44.96,31.5 51.05,31.5 51.94,32.38 62.74,32.38 64.77,34.42
  Bottom 0.406: SPI.6 65.96,35.61 64.77,34.42
D17_A2  (via drill 0.3)
  Top 0.203: IC1.28 34.94,29.07 35.56,28.45 v35.56,27.43 | R13.1 R12.2 52.7,18.53 52.07,17.91 v52.07,17.53
  Bottom 0.203: v35.56,27.43 35.69,27.3 39.12,27.3 41.15,25.27 41.15,21.46 42.55,20.07 49.53,20.07 v52.07,17.53
GND  (via drill 0.3, 0.3 pad 0.76)
  Top 0.203: LED16.C LED18.C 6.87,39.26 7.24,39.62 9.91,39.62
  Top 0.254: 41.91,13.72 40.89,13.72 | 39.12,13.72 38.1,13.72
  Top 0.305: 10.67,11.68 12.95,11.68
  Top 0.406: 44.2,19.05 45.97,19.05
  Top 0.61: IC6.TP v40.01,16.76 | IC6.4 40.01,13.08 40.89,13.08 | 36.58,10.92 41.02,10.92 | 48.77,25.53 46.23,25.53 C9.1 | v39.12,16.76 v40.01,16.76 | v40.01,16.76 v40.89,16.76
  Top 0.813: 40.01,13.08 IC6.TP
  other vias: 34.92,16.76 42.67,27.69 50.8,12.19 51.56,12.19 52.32,12.19 52.58,12.95 51.56,11.43 52.32,11.43 50.8,10.67 51.56,10.67 52.32,10.67 52.58,9.91 50.04,11.43 49.28,11.43 50.04,12.19 49.28,12.19 50.04,10.67 49.28,10.67 55.88,12.19 56.64,12.19 56.64,11.43 56.64,10.67 55.88,10.67 55.12,10.67 55.12,11.43 55.12,12.19 54.36,12.19 54.36,11.43 54.36,10.67 57.4,10.67 57.4,11.43 57.4,12.19 54.1,12.95 54.1,9.91 57.66,12.95 57.66,9.91 40.89,14.99 39.12,14.1 39.12,14.99 40.01,14.1 40.89,14.1 40.89,15.88 40.01,15.88 39.12,15.88 39.12,13.21 40.01,13.21 40.89,13.21 13.08,28.45 14.22,28.45 14.22,27.3 13.08,27.3 13.08,26.04 14.22,26.04 14.22,24.89 13.08,24.89 15.49,28.45 16.64,28.45 16.64,27.3 15.49,27.3 15.49,26.04 16.64,26.04 16.64,24.89 15.49,24.89 25.27,28.19 25.27,27.18 26.29,27.18 26.29,28.19 28.19,28.19 29.21,28.19 29.21,27.18 28.19,27.18 25.27,25.27 26.29,25.27 25.27,24.26 26.29,24.26 28.19,24.26 28.19,25.27 29.21,25.27 29.21,24.26 21.21,35.94 28.96,36.07 32.77,36.2 38.23,38.1 44.7,35.31 49.02,37.85 50.55,34.67 9.53,18.16 20.32,21.46 9.53,35.18 9.53,29.46 9.53,22.99 9.53,26.29 15.62,40.64 17.91,37.72 22.61,40.64 29.46,40.64 36.58,40.64 43.56,40.64 54.36,40.64 10.67,1.65 32.26,21.46 18.54,34.92 35.18,9.65 31.88,3.17 30.1,9.65 48.01,3.17 57.91,18.29 60.45,9.65 60.58,40.39 33.91,34.16 45.47,32.51 45.47,30.35 22.86,3.17 13.59,11.43 40.01,3.17 56.01,3.17 49.15,9.91 49.15,12.95 59.31,1.65 68.33,10.67 68.33,39.37 9.65,40.39 9.78,9.78 50.55,40.64 46.61,14.35 24,11.68 16.64,14.1 27.69,15.75 20.45,17.14 59.05,31.37 52.58,24.64 52.58,21.84 38.86,30.1 50.55,24.64 26.42,3.17 44.32,23.11 39.62,20.07 67.06,30.1 20.32,28.07 20.32,23.88 42.8,33.78 29.34,21.46 16.26,22.86 31.5,23.37 17.14,17.02 12.45,18.16 23.11,21.46 23.11,23.88
  pour Top (isolate 0.15): 10,1 60,1 60,8 62,10 69,10 69,40 62,40 60,42 60,49 10,49 10,42 9,41 9,9 10,8
  pour Bottom (isolate 0.15): 10,49 10,42 9,41 9,9 10,8 10,1 60,1 60,8 62,10 69,10 69,40 62,40 60,42 60,49
IO15  (via drill 0.3)
  Top 0.203: IC1.45 16.75,32.5 v16.51,32.26
  Bottom 0.203: v16.51,32.26 TP8.1
IO16
  Top 0.203: R10.1 11.18,37.97 11.18,35.81 12.06,34.92 14.99,34.92 15.55,34.36 IC1.46
IO18
  Top 0.203: R11.1 10.67,36.96 10.67,35.56 11.68,34.54 14.22,34.54 14.36,34.41 IC1.47
J1_D15_A0
  Top 0.203: IC1.31 34.96,32.67 35.31,33.02 35.31,34.16 35.69,34.54 36.58,34.54 36.83,34.8 39.75,34.8 40.01,34.54 48.77,34.54 49.02,34.8 T7.2 49.02,35.56 49.28,35.81 50.42,35.81 50.98,36.37 53.1,36.37 | D13.3 53.1,36.37 | 53.1,36.37 53.1,36.84 54.1,37.85 57.66,37.85 58.04,38.23 58.04,38.73 | R24.2 58.04,38.73 | 58.04,38.73 R25.2
J2_D25_A7/AREF
  Top 0.203: T6.2 37.97,36.58 38.35,36.2 38.35,35.18 | 38.35,35.18 40.01,35.18 40.26,34.92 41.27,34.92 42.55,36.2 D12.3 46.74,36.2 46.99,36.45 46.99,37.47 47.62,38.1 47.62,39.24 48.14,39.76 50.68,39.76 51.19,40.27 R27.2 52.97,40.27 53.34,40.64 53.34,42.16 52.95,42.55 R28.2 | 38.35,35.18 36.58,35.18 36.32,34.92 31.62,34.92 31.16,34.46 IC1.33
J3_D18_A3  (via drill 0.3)
  Top 0.203: IC1.34 29.95,34.65 v30.1,34.8 | v40.77,35.56 40.77,36.2 | 40.77,36.2 D11.3 | 40.77,36.2 40.39,36.58 T6.5 39.12,36.58 38.61,37.08 38.61,37.59 38.99,37.97 44.32,37.97 45.47,39.12 R30.2 45.98,40.27 46.35,40.64 46.35,42.16 45.97,42.55 R31.2
  Bottom 0.203: v40.77,35.56 40.39,35.18 30.48,35.18 v30.1,34.8
J4_D19_A4
  Top 0.203: T5.2 25.65,36.7 26.04,36.32 26.04,35.69 26.29,35.43 28.75,35.43 | IC1.35 28.75,35.43 | 36.32,36.7 36.32,37.72 38.48,39.88 R33.2 39,40.27 39.37,40.64 39.37,42.16 38.98,42.55 R34.2 | D10.3 36.32,36.7 | 28.75,35.43 30.61,35.43 30.73,35.31 36.07,35.31 36.32,35.56 36.32,36.7
J5_D20_A5  (via drill 0.3)
  Top 0.203: IC1.36 27.55,34.56 v27.81,34.82 | D9.3 v28.19,36.7 T5.5 26.92,36.7 26.54,37.08 26.54,37.97 30.23,37.97 31.37,39.12 R36.2 31.89,40.27 32.26,40.64 32.26,42.16 31.87,42.55 R37.2
  Bottom 0.203: v27.81,34.82 27.81,36.32 v28.19,36.7
J6_D21_A6
  Top 0.203: T4.2 12.7,36.58 13.21,36.07 13.21,35.56 13.46,35.31 14.99,35.31 15.24,35.56 19.18,35.56 19.56,35.18 24,35.18 | IC1.37 26.36,34.35 25.78,34.92 24.26,34.92 24,35.18 | 24,36.7 24,38.73 24.38,39.12 R39.2 24.9,40.27 25.27,40.64 25.27,42.16 24.88,42.55 R40.2 | 24,36.7 24,35.18 | D8.3 24,36.7
J7_D16_A1  (via drill 0.3)
  Top 0.203: IC1.27 32.84,27.87 v32.77,27.94 | D7.3 v17.14,36.7 14.73,36.7 14.61,36.58 T4.5 13.84,36.58 13.46,36.96 13.46,37.59 13.84,37.97 16.26,37.97 17.4,39.12 R42.2 17.91,40.27 18.29,40.64 18.29,42.16 17.9,42.55 R43.2
  Bottom 0.203: v32.77,27.94 32.77,28.45 32.26,28.96 19.3,28.96 17.14,31.11 v17.14,36.7
LED_SWDIO_D37  (via drill 0.3)
  Top 0.203: v32.77,26.67 IC1.26 36.2,26.67 36.58,27.05 R14.1
  Bottom 0.203: v32.77,26.67 33.4,26.67 SWDIO.1
M1_O1
  Top 0.305: IC3.7 50.3,8.14 50.04,7.87 46.1,7.87 45.09,6.86 38.73,6.86 36.88,5
  Top 0.406: M1.2 36.88,5
M1_O2
  Top 0.305: IC3.6 49.8,8.53 49.66,8.38 45.85,8.38 44.83,7.37 38.48,7.37 37.08,5.97 32,5.97 31.88,5.84 31.84,5.84
  Top 0.406: 31.84,5.84 M1.1
M1A_D7  (via drill 0.3)
  Top 0.203: IC3.4 50.3,15.08 v50.14,15.24 | IC1.14 25.16,20.96 v25.27,21.08
  Bottom 0.203: v50.14,15.24 50.14,16.15 47.75,18.54 27.81,18.54 v25.27,21.08
M1B_D6  (via drill 0.3)
  Top 0.203: IC3.5 49.8,14.59 v49.28,15.11 | IC1.13 23.95,21.03 v24,21.08
  Bottom 0.203: v49.28,15.11 49.28,16.23 47.32,18.19 26.9,18.19 v24,21.08
M2_O1
  Top 0.305: IC3.10 51.8,8.4 51.82,8.38 51.82,7.62 50.8,6.6 46.74,6.6 45.13,5
  Top 0.406: M2.2 45.13,5
M2_O2
  Top 0.305: IC3.9 51.3,7.87 50.55,7.11 46.48,7.11 45.34,5.97 40.01,5.97 39.88,5.84 39.84,5.84
  Top 0.406: 39.84,5.84 M2.1
M2A_D1  (via drill 0.3)
  Top 0.203: IC3.1 51.8,14.59 v52.32,15.11 | IC1.16 27.55,20.95 v27.69,21.08
  Bottom 0.203: v52.32,15.11 52.32,15.49 48.56,19.25 29.52,19.25 v27.69,21.08
M2B_D0  (via drill 0.3)
  Top 0.203: IC3.2 51.3,15.05 v51.46,15.21 | IC1.15 26.36,20.89 v26.54,21.08
  Bottom 0.203: v51.46,15.21 51.44,15.24 51.44,15.62 48.16,18.9 28.73,18.9 v26.54,21.08
M3_O1
  Top 0.305: IC4.7 55.38,7.75 52.62,5
  Top 0.406: M3.2 52.62,5
M3_O2
  Top 0.305: IC4.6 54.88,8.27 52.58,5.97 48.01,5.97 47.88,5.84 47.84,5.84
  Top 0.406: 47.84,5.84 M3.1
M3A_D3  (via drill 0.3)
  Top 0.203: IC4.4 55.38,15.08 v55.22,15.24 | IC1.41 21.55,31.91 21.84,31.62 v21.84,30.48
  Bottom 0.203: v21.84,30.48 22.73,30.48 23.5,29.72 37.02,29.72 38.54,28.19 39.62,28.19 42.16,25.65 42.16,21.72 43.05,20.83 50.42,20.83 55.22,16.03 v55.22,15.24
M3B_D2  (via drill 0.3)
  Top 0.203: IC4.5 54.88,14.59 v54.36,15.11 | IC1.40 22.75,30.12 v22.48,29.84
  Bottom 0.203: v54.36,15.11 54.36,16.13 50.04,20.45 42.8,20.45 41.66,21.59 41.66,25.46 39.37,27.75 38.29,27.75 36.7,29.34 22.99,29.34 v22.48,29.84
M4_O1
  Top 0.305: IC4.10 56.88,8.27 57.02,8.13 57.02,5.02 M4.2
M4_O2
  Top 0.305: IC4.9 56.38,7.1 54.99,5.71 M4.1
M4A_D5  (via drill 0.3)
  Top 0.203: IC4.1 56.88,14.59 v57.4,15.11 | IC1.44 17.95,32.72 18.67,32 19.3,32 19.94,31.37 v20.32,31.37
  Bottom 0.203: v57.4,15.11 57.4,15.37 51.18,21.59 43.56,21.59 43.18,21.97 43.18,26.04 40.13,29.08 38.86,29.08 37.47,30.48 23.75,30.48 22.48,31.75 20.7,31.75 v20.32,31.37
M4B_D4  (via drill 0.3)
  Top 0.203: IC4.2 56.38,15.08 v56.54,15.24 | v21.21,31.11 21.21,31.5 20.7,32 19.94,32 19.16,32.79 IC1.43
  Bottom 0.203: v56.54,15.24 56.54,15.21 56.54,15.47 50.8,21.21 50.55,21.21 43.31,21.21 42.67,21.84 42.67,25.84 39.88,28.64 38.67,28.64 37.21,30.1 23.62,30.1 22.61,31.11 v21.21,31.11
MISO_D10_LV  (via drill 0.3)
  Top 0.203: R19.1 v48.77,27.69 | v19.05,31.37 19.18,31.37 22.1,28.45 22.1,21.46 22.75,20.81 IC1.12
  Bottom 0.203: v48.77,27.69 47.12,27.69 42.67,32.13 41.27,32.13 40.77,31.62 24.89,31.62 24,32.51 19.68,32.51 19.05,31.88 v19.05,31.37
MISO_HV  (via drill 0.3)
  Top 0.203: IC2.6 42.73,30.41 43.18,30.86 43.18,32.51 v43.94,33.27
  Bottom 0.203: v43.94,33.27 44.2,33.53 47.37,33.53 47.62,33.27 48.39,33.27 48.64,33.53 57.91,33.53 58.8,34.42
  Bottom 0.406: SPI.3 60,35.62 58.8,34.42
MISO_LV
  Top 0.203: R19.2 48.14,29.58 47.97,29.76 IC2.14
MOSI_D8_LV  (via drill 0.3)
  Top 0.203: IC2.2 40.27,33.01 v39.62,33.66 | 17.95,20.32 17.91,20.32 17.95,20.27 IC1.8 17.95,20.62 18.41,21.08 18.41,28.96 17.78,29.59 v17.78,31.5
  Bottom 0.203: v39.62,33.66 38.99,33.66 38.61,33.27 19.18,33.27 17.78,31.88 v17.78,31.5
MOSI_HV  (via drill 0.3)
  Top 0.203: IC2.18 48.11,32.36 v48.26,32.51
  Bottom 0.203: v48.26,32.51 48.39,32.51 49.02,33.15 59.56,33.15 60.83,34.42
  Bottom 0.406: SPI.4 61.96,35.54 60.83,34.42
N$1
  Top 0.203: LED8.A R22.2
N$2
  Top 0.406: R24.1 56.52,41.98 J1.3
N$3
  Top 0.813: T1.3 18.67,15.88 F2.2
N$4  (via drill 0.3)
  Top 0.203: R8.1 v16,11.05 R7.2 | T1.1 22.8,14.93 22.48,14.61 v20.45,14.61
  Bottom 0.203: v20.45,14.61 19.18,14.61 18.92,14.61 16,11.68 16,11.43 v16,11.05
N$5
  Top 0.203: LED9.A 37.97,26.04 37.85,26.16 37.85,26.92 R14.2
N$11
  Top 0.203: T2.1 25.97,10.35 26.67,9.65 R23.2 | R23.2 | R23.2 27.42,8.02 R21.2 27.44,7.61 28,7.05 R22.1
N$16
  Top 0.203: LED7.C 11.68,38.73 11.68,36.07 11.93,35.83 T4.3
N$17
  Top 0.203: LED7.A R44.1
N$18
  Top 0.406: J7.3 15.53,42 16.26,41.27 R42.1
N$22
  Top 0.203: C4.1 29.34,10.8 29.97,11.43 29.97,12.19 30.54,12.76 L1.1 34.61,12.76
  Top 0.61: 37.34,14.29 IC6.3
  Top 0.813: 36.01,14.16 36.13,14.29 37.34,14.29
  Top 1.016: 36.01,14.16 34.61,12.76 34.48,12.64
N$24
  Top 0.203: IC6.8 43.56,16.89 43.81,17.14 C3.2
N$25
  Top 0.406: J6.3 22.52,42 23.25,41.27 R39.1
N$26
  Top 0.406: J5.3 29.5,42 30.23,41.27 R36.1
N$27
  Top 0.406: J4.3 36.49,42 37.22,41.27 R33.1
N$29
  Top 0.203: R4.1 R5.2 44.19,11.5 IC6.5
N$30
  Top 0.203: LED6.C 17.65,38.73 16.24,37.33 T4.6
N$31
  Top 0.203: LED6.A R41.1
N$32
  Top 0.406: J2.3 50.46,42 51.19,41.27 R27.1
N$33
  Top 0.15: LED5.A R38.1
N$34
  Top 0.406: J3.3 43.47,42 44.2,41.27 R30.1
N$35
  Top 0.203: LED4.A R35.1
N$36
  Top 0.203: T5.6 30.34,37.45 31.62,38.73 LED4.C
N$37
  Top 0.203: T5.3 25.01,35.95 24.77,36.2 24.77,38.23 25.27,38.73 LED5.C
N$38
  Top 0.203: LED3.A R32.1
N$39
  Top 0.203: LED2.A R29.1
N$40
  Top 0.203: T6.6 42.28,37.33 42.55,37.59 44.58,37.59 45.72,38.73 LED2.C
N$41
  Top 0.203: T6.3 37.07,35.83 36.83,36.07 36.83,37.59 37.97,38.73 LED3.C
N$42
  Top 0.203: R26.1 51.94,38.35 53.09,39.5 54.99,39.5 55.24,39.24 55.24,38.85 LED1.A
N$43
  Top 0.203: LED1.C 53.72,38.73 52.7,37.72 52.7,37.08 52.45,36.83 50.8,36.83 50.16,36.2 48.51,36.2 48.27,36.44 T7.6
N$44
  Top 0.203: R3.1 45.46,13.58 44.58,12.7 44.58,12.58 C5.2
N$46
  Top 0.203: IC6.7 43.43,15.62 43.94,16.13 R1.1 R2.2
N$60
  Top 0.203: LED18.A R11.2
N$61
  Top 0.203: LED16.A R10.2
RST  (via drill 0.3)
  Top 0.203: v32.77,24.13 32.91,24.27 IC1.24 34.91,24.27 35.56,23.62 R9.2 C14.2 | R45.1 C14.2 | C14.2
  Bottom 0.203: RST.1 32.77,23.5 v32.77,24.13
RST_SW  (via drill 0.3)
  Top 0.203: RESET.3 41.25,19.59 v40.64,20.19 | R45.2 39.88,24.77 v39.88,24.64 40.51,25.27 RESET.2
  Bottom 0.203: v40.64,20.19 39.88,20.95 v39.88,24.64
RTC  (via drill 0.3)
  Top 0.203: IC1.5 14.36,20.83 v14.61,21.08
  Bottom 0.203: v14.61,21.08 TP7.1
RX_D13_LV
  Top 0.203: IC1.23 34.84,23.07 35.43,22.48 R20.1
RX_HV  (via drill 0.3)
  Top 0.203: 65.02,15.49 v65.02,27.43 | v48.77,30.48 48.7,30.41 IC2.15
  Top 0.406: UART.3 64.03,14.5 65.02,15.49
  Bottom 0.203: v65.02,27.43 65.02,29.08 64.26,29.84 49.4,29.84 v48.77,30.48
RX_LV
  Top 0.203: IC2.5 40.08,31.06 39.62,30.61 39.62,27.69 40.77,26.54 41.91,26.54 42.42,26.04 42.42,24.26 42.04,23.88 40.01,23.88 38.61,22.48 R20.2
RXD  (via drill 0.3)
  Top 0.203: IC1.3 11.96,20.97 v12.06,21.08
  Bottom 0.203: v12.06,21.08 TP4.1
S1
  Top 0.61: T2.3 25.02,7.87 22.99,5.84
  Top 1.016: D6.A 19.05,5.97 19.18,5.84 22.99,5.84 23,5.83 S1.1
S1_SWCLK_D36  (via drill 0.3)
  Top 0.203: v32.77,25.4 32.84,25.47 IC1.25 35.49,25.47 v35.56,25.4 | R21.1 v28.45,8.89
  Bottom 0.203: v32.77,25.4 33.02,25.4 33.91,24.51 SWCLK.1 | v28.45,8.89 29.46,7.87 52.2,7.87 53.34,9.02 53.34,15.24 48.9,19.68 42.29,19.68 40.64,21.34 40.64,25.02 40.26,25.4 v35.56,25.4
SCK_D9_LV  (via drill 0.3)
  Top 0.203: IC2.4 40.3,31.71 v39.24,32.77 | IC1.9 19.16,29.36 18.92,29.59 v18.92,30.48
  Bottom 0.203: v39.24,32.77 39.12,32.89 19.43,32.89 18.41,31.88 18.41,30.99 v18.92,30.48
SCK_HV  (via drill 0.3)
  Top 0.203: IC2.16 48.08,31.06 v49.15,32.13
  Bottom 0.203: v49.15,32.13 49.78,32.77 61.09,32.77 62.74,34.42
  Bottom 0.406: SPI.5 63.96,35.64 62.74,34.42
SCL  (via drill 0.3)
  Top 0.203: v12.7,32.26 13.15,32.71 IC1.48
  Bottom 0.203: TP5.1 v12.7,32.26
SCL_D12_LV  (via drill 0.3)
  Top 0.203: R15.1 51.94,27.81 v52.2,27.56 52.45,27.56 53.09,28.19 53.09,28.96 52.95,29.09 T3.4 | IC1.39 23.95,31.67 v24,31.62
  Bottom 0.203: v52.2,27.56 51.69,27.05 47.12,27.05 42.42,31.75 41.66,31.75 41.15,31.24 24.38,31.24 v24,31.62
SCL_HV  (via drill 0.3)
  Top 0.203: T3.3 51.18,29.08 51.69,29.08 v51.94,28.83
  Top 0.406: I2C/WIRE..3 I2C/WIRE.3 64,29.34 63.5,29.84 R16.1 63.49,30.99
  Bottom 0.203: v51.94,28.83 52.2,28.83 53.85,27.18 62.74,27.18 62.99,27.43
  Bottom 0.406: I2C/WIRE.3 64,28.44 62.99,27.43
SDA  (via drill 0.3)
  Top 0.203: v11.43,32.26 11.96,32.78 IC1.49
  Bottom 0.203: TP6.1 v11.43,32.26
SDA_D11_LV  (via drill 0.3)
  Top 0.203: v52.96,31.75 R17.1 52.06,31.49 T3.1 | IC1.38 v25.16,32.27 v25.15,32.26
  Bottom 0.203: v52.96,31.75 R17.1 51.44,31.11 44.32,31.11 42.93,32.51 40.89,32.51 40.51,32.13 25.27,32.13 v25.15,32.26
SDA_HV  (via drill 0.3)
  Top 0.203: T3.6 52.98,30.61 v52.2,30.61
  Top 0.406: I2C/WIRE..4 I2C/WIRE.4 65.96,29.29 64.77,30.48 R18.1
  Bottom 0.203: v52.2,30.61 52.32,30.48 64.9,30.48 65.91,29.46
  Bottom 0.305: I2C/WIRE.4 65.96,28.53 65.91,28.57 65.91,29.46
SHLD1
  Top 0.406: USB.SHLD1 13.54,10.2 R6.2
  Bottom 0.61: USB.SHLD2 11.36,15.8 10.03,14.48 10.03,12.95 | USB.SHLD1 11.39,10.2 10.03,11.56 10.03,12.95 | USB.SHLD3 10,12.99 10.03,12.95
TX_D14_LV
  Top 0.203: IC1.22 34.77,21.87 34.92,21.72 38.48,21.72 40.13,23.37 42.29,23.37 42.93,24 42.93,26.67 45.37,29.11 IC2.13
TX_HV  (via drill 0.3)
  Top 0.203: 67.18,15.75 67.18,26.54 v67.06,26.67 | v42.42,29.72 42.38,29.76 IC2.7
  Top 0.406: UART.4 65.96,14.53 67.18,15.75
  Bottom 0.203: v67.06,26.67 45.47,26.67 v42.42,29.72
TXD  (via drill 0.3)
  Top 0.203: IC1.2 10.79,19.86 v10.79,21.08
  Bottom 0.203: v10.79,21.08 TP3.1
USB_N  (via drill 0.3)
  Top 0.203: IC1.18 29.95,20.58 30.33,20.95 30.33,22.79 v30.31,22.81 | D-.1 13.97,14.22 13.48,13.73 D14.1 12.85,13.73 12.76,13.65 USB.D-
  Bottom 0.203: v30.31,22.81 30.25,22.81 29.97,22.53 19.18,22.53 arc90 15.57,18.92 15.57,14.86 arc-90 14.35,13.64 arc-90 13.97,14.02 D-.1
  other vias: 13.97,14.35
USB_P  (via drill 0.3)
  Top 0.203: IC1.19 31.16,20.68 30.88,20.95 30.88,21.95 v31.03,22.1 | D+.1 13.61,12.94 D14.2 12.85,12.94 12.78,13 USB.D+
  Bottom 0.203: D+.1 14.1,13.03 arc-90 14.35,13.29 arc90 15.93,14.86 15.93,18.92 arc-90 19.18,22.18 30.73,22.18 30.81,22.1 v31.03,22.1
  other vias: 14.1,12.45
V+  (via drill 0.3)
  Top 0.203: R12.1 53.09,16.37 | C19.1 50.55,16.38 50.67,16.26 50.8,16.26 50.68,16.37 50.67,16.37
  Top 0.305: IC3.3 50.8,16.26 | IC4.3 55.88,16.37 C20.1
  Top 0.61: 25.02,2.03 25.02,1.91 25.15,1.78
  Top 0.813: 50.56,16.37 50.55,16.38 | 56.77,1.78 58.67,3.68 58.67,15.62 57.92,16.37 55.88,16.37 53.09,16.37 50.67,16.37 | 26.4,1.79 26.42,1.78 | 18.03,12.32 F1.2
  Top 1.016: 56.77,1.78 26.42,1.78 25.15,1.78 19.05,1.78 D6.C | v19.43,11.56 v19.43,12.32 | v19.43,12.32 v19.43,13.08 | v19.43,12.32 F1.2
  Top 1.27: S1.2 25,2.05 25.02,2.03
  Bottom 0.406: 25.02,4.97 25.02,4.98 S1.2
  Bottom 1.016: v19.43,12.32 v19.43,13.08 | v19.43,12.32 v19.43,11.56 | 20.07,12.32 v19.43,12.32
  Bottom 1.27: v25.02,3.56 25.02,4.97 | S1.2 25,7.38 20.07,12.32
VBUS  (via drill 0.3)
  Top 0.203: USB.VBUS 10.97,14.3 9.78,15.49 VBUS.1 | 13.72,15.49 C10.2
  Top 0.406: USB.VBUS 12.52,14.3 12.95,14.73
  Top 0.61: 12.95,14.73 13.72,15.49 15.49,15.49 F2.1
  other vias: 9.78,16.26
VIN
  Top 0.203: 16,7.49 16.19,7.3 | R8.2 16,7.24 16.07,7.18
  Top 1.016: 17.78,8.89 17.53,8.64
  Top 1.27: POWER.2 15,6.11 16.07,7.18 16.19,7.3 17.53,8.64 17.65,8.76 | 17.78,8.89 17.98,8.89 D1.A
VINP  (via drill 0.3)
  Top 0.203: R1.2 v46.48,16.13
  Top 0.406: v31.88,15.24 31.88,14.8
  Top 0.813: IC6.2 35.18,15.62 35.05,15.49
  Top 1.016: 34.23,14.8 34.36,14.8 35.05,15.49
  Top 1.27: 34.23,14.8 C2.2 31.88,14.8 C1.2 28.64,14.8 26.88,13.03 D2.C 22.05,13.03 21.97,12.95 F1.1 21.97,10.29 21.51,9.83 D1.C
  Bottom 0.203: v46.48,16.13 46.48,17.14 45.85,17.78 34.42,17.78 v31.88,15.24
WRST  (via drill 0.3)
  Top 0.203: IC1.50 10.76,32.85 v10.16,32.26
  Bottom 0.203: v10.16,32.26 TP2.1
XIN
  Top 0.203: C17.1 37.71,28.84 37.21,29.34 Q1.2 36.94,29.74 36.2,30.48 34.8,30.48 34.59,30.27 IC1.29
XOUT
  Top 0.203: C18.1 37.71,33.14 37.21,32.64 Q1.1 36.94,32.24 35.94,31.24 34.8,31.24 34.57,31.47 IC1.30

### Text on the board
Top: TOP
Bottom: BOT | Gnd | DIO | Made by Watterott electronic | CLK | RST | 3V
tPlace: IO 5V GND | IO 5V GND | Status | GND 5V MISO MOSI SCK CS | GND 5V SCL SDA | GND 5V SCL SDA | Eitech / Robotics / 1.0 | GND 5V RX TX | - | + | + | ______________Motor______________ | 7-14V
bPlace: J7 | J6 | J5 | J4 | J3 | J2 | J1 | IO 5V GND | IO 5V GND | SPI | CS SCK MOSI MISO 5V GND | robotics | I2C | SDA SCL 5V GND | http://www.eitech.de | I2C | SDA SCL 5V GND | UART | TX RX 5V GND | - | + | POWER | S1 | M1 | M2 | M3 | M4
Reference: Silkscreen: 21 tPlace + 22 bPlace